# Altium project goodfet22a.PrjPcb
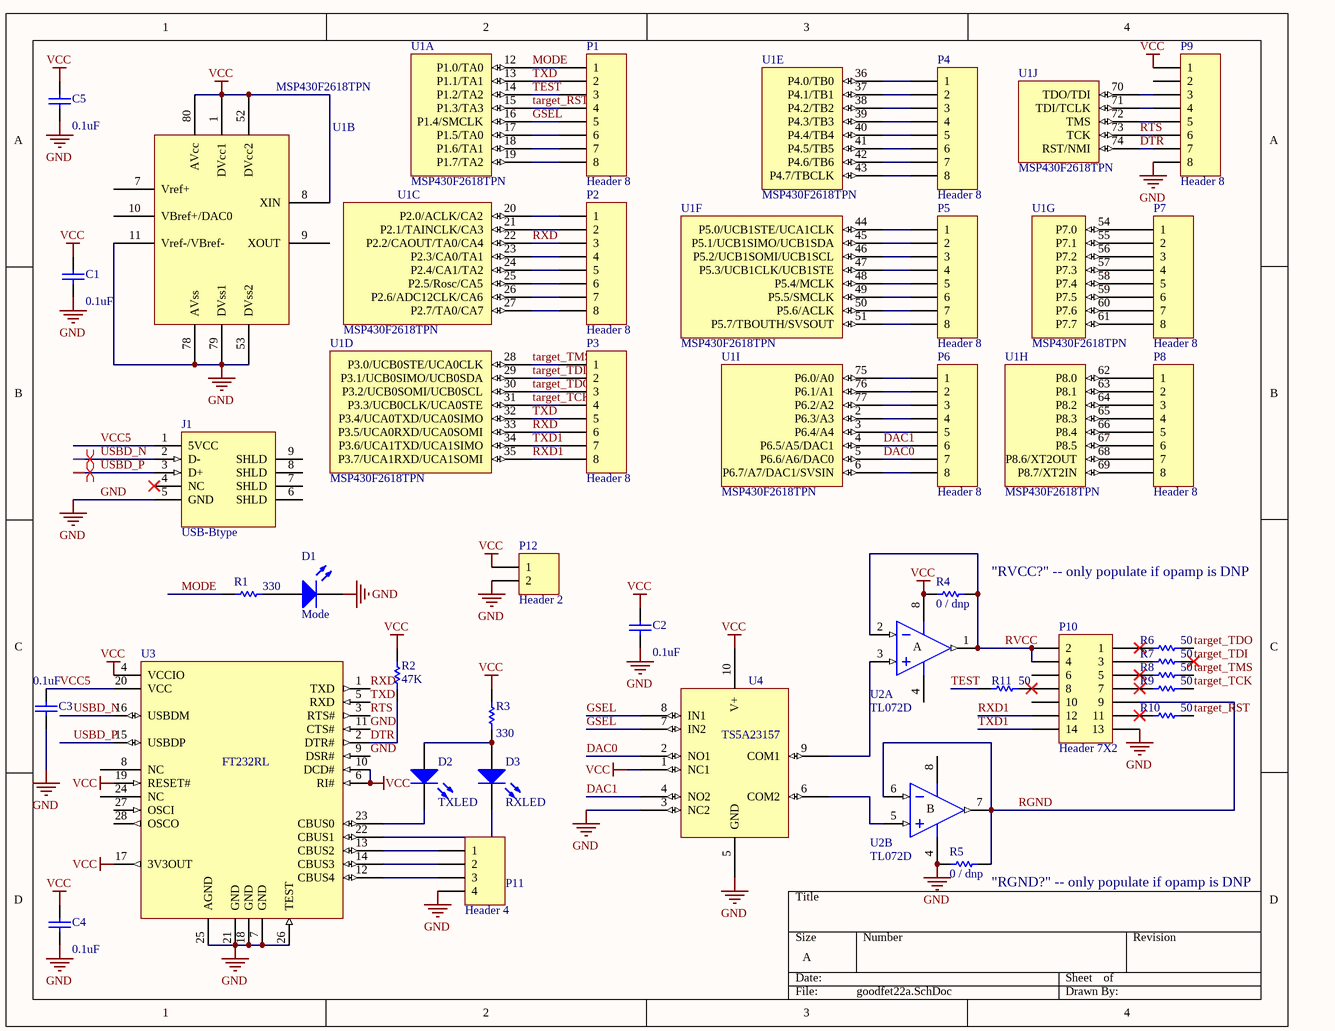
[diagram p0: goodfet22a.SchDoc]
1 sheet, 36 parts. Net scope: global (net labels, ports and power ports of the same name join across sheets).
Board file: goodfet22a.PcbDoc

## Sheet goodfet22a.SchDoc
size A

### Parts
C1  value 0.1uF  [CAPC2512L]  (hidden comment: Cap Semi)
C2  value 0.1uF  [CAPC2512L]  (hidden comment: Cap Semi)
C3  value 0.1uF  [CAPC2512L]  (hidden comment: Cap Semi)
C4  value 0.1uF  [CAPC2512L]  (hidden comment: Cap Semi)
C5  value 0.1uF  [CAPC2512L]  (hidden comment: Cap Semi)
D1  Mode  [DSO-F2/D6.1]
D2  TXLED  [DSO-F2/D6.1]
D3  RXLED  [DSO-F2/D6.1]
J1  USB-Btype  [440479]
P1  Header 8  [HDR1X8]
P2  Header 8  [HDR1X8]
P3  Header 8  [HDR1X8]
P4  Header 8  [HDR1X8]
P5  Header 8  [HDR1X8]
P6  Header 8  [HDR1X8]
P7  Header 8  [HDR1X8]
P8  Header 8  [HDR1X8]
P9  Header 8  [HDR1X8]
P10  Header 7X2  [HDR2X7]
P11  Header 4  [HDR1X4]
P12  Header 2  [HDR1X2]
R1  value 330  [RESC2012L]  (hidden comment: Res Semi)
R2  value 47K  [RESC2012L]  (hidden comment: Res Semi)
R3  value 330  [RESC2012L]  (hidden comment: Res Semi)
R4  value 0 / dnp  [RESC2012L]  (hidden comment: Res Semi)
R5  value 0 / dnp  [RESC2012L]  (hidden comment: Res Semi)
R6  value 50  [RESC2012L]  (hidden comment: Res Semi)
R7  value 50  [RESC2012L]  (hidden comment: Res Semi)
R8  value 50  [RESC2012L]  (hidden comment: Res Semi)
R9  value 50  [RESC2012L]  (hidden comment: Res Semi)
R10  value 50  [RESC2012L]  (hidden comment: Res Semi)
R11  value 50  [RESC2012L]  (hidden comment: Res Semi)
U1  MSP430F2618TPN  [TSQFP50P1400X1400X160-80N]  (parts A,B,C,D,E,F,G,H,I,J of 10)
U2  TL072D  [D008_L]  (parts A,B of 2)
U3  FT232RL  [SOP65P780X200-28N]
U4  TS5A23157  [TSSOP50P490X110-10N]

### Nets
GND: C1.1 C2.1 C3.1 C4.1 C5.1 D1.2(K) J1.5(GND) P9.8 P10.13 P11.4 P12.2 R5.1 U1.11(Vref-/VBref-) U1.53(DVss2) U1.78(AVss) U1.79(DVss1) U2.4(V-) U3.7(GND) U3.9(DSR#) U3.11(CTS#) U3.18(GND) U3.21(GND) U3.25(AGND) U3.26(TEST) U4.3(NC2) U4.5(GND)
VCC: C1.2 C2.2 C4.2 C5.2 P9.1 P12.1 R2.2 R3.2 R4.2 U1.1(DVcc1) U1.8(XIN) U1.52(DVcc2) U1.80(AVcc) U2.8(V+) U3.4(VCCIO) U3.6(RI#) U3.10(DCD#) U3.17(3V3OUT) U3.19(RESET#) U4.1(NC1) U4.10(V+)
DAC0: P6.7 U1.5(P6.6/A6/DAC0) U4.2(NO1)
DAC1: P6.6 U1.4(P6.5/A5/DAC1) U4.4(NO2)
DTR: P9.7 R2.1 U1.74(RST/NMI) U3.2(DTR#)
GSEL: P1.5 U1.16(P1.4/SMCLK) U4.7(IN2) U4.8(IN1)
MODE: P1.1 R1.1 U1.12(P1.0/TA0)
RGND: P10.9 R5.2 U2.6(IN-) U2.7(OUT)
RTS: P9.6 U1.73(TCK) U3.3(RTS#)
RVCC: P10.2 P10.4 R4.1 U2.1(OUT) U2.2(IN-)
RXD: P2.3 P3.6 U1.22(P2.2/CAOUT/TA0/CA4) U1.33(P3.5/UCA0RXD/UCA0SOMI) U3.1(TXD)
RXD1: P3.8 P10.12 U1.35(P3.7/UCA1RXD/UCA1SOMI)
target_RST: P1.4 R10.2 U1.15(P1.3/TA3)
target_TCK: P3.4 R9.2 U1.31(P3.3/UCB0CLK/UCA0STE)
target_TDI: P3.2 R7.2 U1.29(P3.1/UCB0SIMO/UCB0SDA)
target_TDO: P3.3 R6.2 U1.30(P3.2/UCB0SOMI/UCB0SCL)
target_TMS: P3.1 R8.2 U1.28(P3.0/UCB0STE/UCA0CLK)
TEST: P1.3 R11.1 U1.14(P1.2/TA2)
TXD: P1.2 P3.5 U1.13(P1.1/TA1) U1.32(P3.4/UCA0TXD/UCA0SIMO) U3.5(RXD)
TXD1: P3.7 P10.14 U1.34(P3.6/UCA1TXD/UCA1SIMO)
USBD_N: J1.2(D-) U3.16(USBDM)
USBD_P: J1.3(D+) U3.15(USBDP)
VCC5: C3.2 J1.1(5VCC) U3.20(VCC)
NetD1_1: D1.1(A) R1.2
NetD2_1: D2.1(A) D3.1(A) R3.1
NetD2_2: D2.2(K) U3.23(CBUS0)
NetD3_2: D3.2(K) U3.22(CBUS1)
NetP1_6: P1.6 U1.17(P1.5/TA0)
NetP1_7: P1.7 U1.18(P1.6/TA1)
NetP1_8: P1.8 U1.19(P1.7/TA2)
NetP2_1: P2.1 U1.20(P2.0/ACLK/CA2)
NetP2_2: P2.2 U1.21(P2.1/TAINCLK/CA3)
NetP2_4: P2.4 U1.23(P2.3/CA0/TA1)
NetP2_5: P2.5 U1.24(P2.4/CA1/TA2)
NetP2_6: P2.6 U1.25(P2.5/Rosc/CA5)
NetP2_7: P2.7 U1.26(P2.6/ADC12CLK/CA6)
NetP2_8: P2.8 U1.27(P2.7/TA0/CA7)
NetP4_1: P4.1 U1.36(P4.0/TB0)
NetP4_2: P4.2 U1.37(P4.1/TB1)
NetP4_3: P4.3 U1.38(P4.2/TB2)
NetP4_4: P4.4 U1.39(P4.3/TB3)
NetP4_5: P4.5 U1.40(P4.4/TB4)
NetP4_6: P4.6 U1.41(P4.5/TB5)
NetP4_7: P4.7 U1.42(P4.6/TB6)
NetP4_8: P4.8 U1.43(P4.7/TBCLK)
NetP5_1: P5.1 U1.44(P5.0/UCB1STE/UCA1CLK)
NetP5_2: P5.2 U1.45(P5.1/UCB1SIMO/UCB1SDA)
NetP5_3: P5.3 U1.46(P5.2/UCB1SOMI/UCB1SCL)
NetP5_4: P5.4 U1.47(P5.3/UCB1CLK/UCB1STE)
NetP5_5: P5.5 U1.48(P5.4/MCLK)
NetP5_6: P5.6 U1.49(P5.5/SMCLK)
NetP5_7: P5.7 U1.50(P5.6/ACLK)
NetP5_8: P5.8 U1.51(P5.7/TBOUTH/SVSOUT)
NetP6_1: P6.1 U1.75(P6.0/A0)
NetP6_2: P6.2 U1.76(P6.1/A1)
NetP6_3: P6.3 U1.77(P6.2/A2)
NetP6_4: P6.4 U1.2(P6.3/A3)
NetP6_5: P6.5 U1.3(P6.4/A4)
NetP6_8: P6.8 U1.6(P6.7/A7/DAC1/SVSIN)
NetP7_1: P7.1 U1.54(P7.0)
NetP7_2: P7.2 U1.55(P7.1)
NetP7_3: P7.3 U1.56(P7.2)
NetP7_4: P7.4 U1.57(P7.3)
NetP7_5: P7.5 U1.58(P7.4)
NetP7_6: P7.6 U1.59(P7.5)
NetP7_7: P7.7 U1.60(P7.6)
NetP7_8: P7.8 U1.61(P7.7)
NetP8_1: P8.1 U1.62(P8.0)
NetP8_2: P8.2 U1.63(P8.1)
NetP8_3: P8.3 U1.64(P8.2)
NetP8_4: P8.4 U1.65(P8.3)
NetP8_5: P8.5 U1.66(P8.4)
NetP8_6: P8.6 U1.67(P8.5)
NetP8_7: P8.7 U1.68(P8.6/XT2OUT)
NetP8_8: P8.8 U1.69(P8.7/XT2IN)
NetP9_3: P9.3 U1.70(TDO/TDI)
NetP9_4: P9.4 U1.71(TDI/TCLK)
NetP9_5: P9.5 U1.72(TMS)
NetP10_1: P10.1 R6.1
NetP10_3: P10.3 R7.1
NetP10_5: P10.5 R8.1
NetP10_7: P10.7 R9.1
NetP10_8: P10.8 R11.2
NetP10_11: P10.11 R10.1
NetP11_1: P11.1 U3.13(CBUS2)
NetP11_2: P11.2 U3.14(CBUS3)
NetP11_3: P11.3 U3.12(CBUS4)
NetU2_3: U2.3(IN+) U4.9(COM1)
NetU2_5: U2.5(IN+) U4.6(COM2)

Not connected (* = marked no-connect by the designer): J1 4(NC)* 6(SHLD) 7(SHLD) 8(SHLD) 9(SHLD); P9 2; P10 6 10; U1 7(Vref+) 9(XOUT) 10(VBref+/DAC0); U3 8(NC) 24(NC) 27(OSCI) 28(OSCO)

### Layout directives
differential pair: USBD_N, USBD_P

### Notes on the sheet
- (near R4) "RVCC?" -- only populate if opamp is DNP
- (near R5) "RGND?" -- only populate if opamp is DNP
- (in symbol TL072D, part A) A
- (in symbol TL072D, part B) B

### Library data of the parts
C1-C5 = Cap Semi: Capacitor (Semiconductor SIM Model); Published: 8-Jun-2000; LatestRevisionDate: 29-May-2009; LatestRevisionNote: IPC-7351 Footprint Added.; PackageReference: C1206; Publisher: Altium Limited; PackageDescription: Chip Capacitor
D1-D3 = LED2: Typical RED, GREEN, YELLOW, AMBER GaAs LED; Published: 8-Jun-2000; LatestRevisionDate: 17-Jul-2002; LatestRevisionNote: Re-released for DXP Platform.; PackageVersion: Feb-2002; PackageReference: 3.2X1.6X1.1; Publisher: Altium Limited
J1 = USB-Btype: USB B Type Right Angle, SMT 5 Pin; ContactMaterial: Phosphor Bronze; ContactPlating: Gold (30) over Nickel; PCB_Layout: Complies with manufacturer's recommendation.; DrillSize: Corresponds to nominal value.; PanelGround: Without; Published: 15-Jul-2004; DatasheetDocument: 28-Jan-2003; PackageDocument: 28-Jan-2003; PackageReference: 440479; Publisher: Altium Limited; HousingMaterial: Thermoplastic; ComponentLink1Description: Manufacturer Link; ComponentLink1URL: http://www.tycoelectronics.com/; ComponentLink2Description: Packaging Specification; ComponentLink2URL: http://ecommas.tycoelectronics.com/commerce/DocumentDelivery/DDEController?Action=showdoc&DocId=Customer+Drawing%7F440479%7FD%7Fpdf%7FEnglish%7FC_440479_D.pdf
P1-P9 = Header 8: Header, 8-Pin; LatestRevisionDate: 17-Jul-2002; LatestRevisionNote: Re-released for DXP Platform.; Publisher: Altium Limited
P10 = Header 7X2: Header, 7-Pin, Dual row; LatestRevisionDate: 17-Jul-2002; LatestRevisionNote: Re-released for DXP Platform.; Publisher: Altium Limited
P11 = Header 4: Header, 4-Pin; LatestRevisionDate: 17-Jul-2002; LatestRevisionNote: Re-released for DXP Platform.; Publisher: Altium Limited
P12 = Header 2: Header, 2-Pin; LatestRevisionDate: 17-Jul-2002; LatestRevisionNote: Re-released for DXP Platform.; Publisher: Altium Limited
R1-R11 = Res Semi: Semiconductor Resistor; Published: 8-Jun-2000; LatestRevisionDate: 17-Jul-2002; LatestRevisionNote: Re-released for DXP Platform.; PackageReference: AXIAL-0.5; Publisher: Altium Limited
U2 = TL072D: Low-Noise JFET-Input Operational Amplifier; Published: 16-Jan-2001; LatestRevisionDate: 13-Apr-2006; LatestRevisionNote: IPC-7351 Footprint Added.; DatasheetVersion: Aug-1996; PackageVersion: Jan-1998; PackageReference: D008; Publisher: Altium Limited; PackageDescription: 8-Pin Small Outline Integrated Circuit 1.27 mm Pitch; Code_IPC: SOIC127P600-8; ComponentLink1Description: Manufacturer Link; ComponentLink1URL: http://www.ti.com/; ComponentLink2Description: Datasheet; ComponentLink2URL: http://www-s.ti.com/sc/ds/tl072.pdf
U3 = FT232RL: USB UART Asynchronous Serial Data Transfer Chip, SOP-28, Pb-Free; Published: 6-Oct-2005; LatestRevisionDate: 13-Apr-2006; LatestRevisionNote: IPC-7351 Footprint Added.; DatasheetVersion: ver 1.7, Feb-2005; PackageVersion: Mar-2004; Publisher: Altium Limited; ComponentLink1Description: Manufacturer Link; ComponentLink1URL: http://www.ftdichip.com/Products/FT232BM.htm; ComponentLink2Description: Datasheet; ComponentLink2URL: http://www.ftdichip.com/Documents/DataSheets/ds232bl17.pdf